# EAGLE design Board_4_Poti (EAGLE 9.6.2)
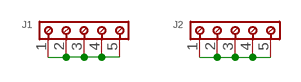
[diagram p0: schematic, sheet 1]

## Parts
J1  691508110305  [691508110305]
J2  691508110305  [691508110305]

## Nets
N$2: J1.1 J1.2 J1.3 J1.4 J1.5
N$3: J2.1 J2.2 J2.3 J2.4 J2.5

## Library data of the parts
J1 J2 = Wurth_Connectors_WR-TBL Rising Cage Clamp:691508110305: WR-TBL Serie 5081 - 3.50 mm Horizontal entry SMT Pressure Clamp KIND PROPERTIES Pitch 3.5 mm MATERIAL PROPERTIES Insulator Material LCP Insulator Flammability Rating UL94 V-0 Insulator Color Black Contact Material Brass Contact Plating Copper over Zinc Terminal Screw Material Steel Terminal Screw Plating Zinc Wire Guard Material Brass GENERAL INFORMATION Operating Temperature -40 up to +130 °C Compliance RoHS ELECTRICAL PROPERTIES IR UL 10 A Working Voltage [UL] 300 V (AC) Withstanding Voltage [UL] 1600 V (AC) Withstanding Voltage [cULus] 1600 V (AC) Contact Resistance [UL] 20 mΩ Contact Resistance [cULus] 20 mΩ MECHANICAL PROPERTIES Wire Strip Length 4 up to 5 (mm) Screw M2 Solid Wire Section (AWG) 30 to 16 (AWG) Solid Wire Section (Metric) 0.05 to 1.31 (mm²) Stranded Wire Section (AWG) 30 to 16 (AWG) Stranded Wire Section (Metric) 0.05 to 1.31 (mm²) CERTIFICATION cULus Approval E315414 UL Approval E315414 PACKAGING PROPERTIES Packaging Tape and Reel with Cap <https://katalog.we-online.com/media/images/v2/o58319v209%20Family_WR-TBL_Serie_5081_6915081103xx.jpg> Details see: https://katalog.we-online.com/en/em/TBL_3_50_5081_6915081103XX Updated by Ella Wu 2019-11-12 2019(C) Wurth Elektronik; DATASHEET-URL: https://www.we-online.com/catalog/datasheet/691508110305.pdf; IR-UL: 10A; MOUNT: THT; PART-NUMBER: 691508110305; PINS: 5; PITCH: 3.5mm; TYPE: Horizontal; WIRE: 30 to 16 (AWG) 0.05 to 1.31 (mm²); WORKING-VOLTAGE-UL: 300V (AC)

## Board
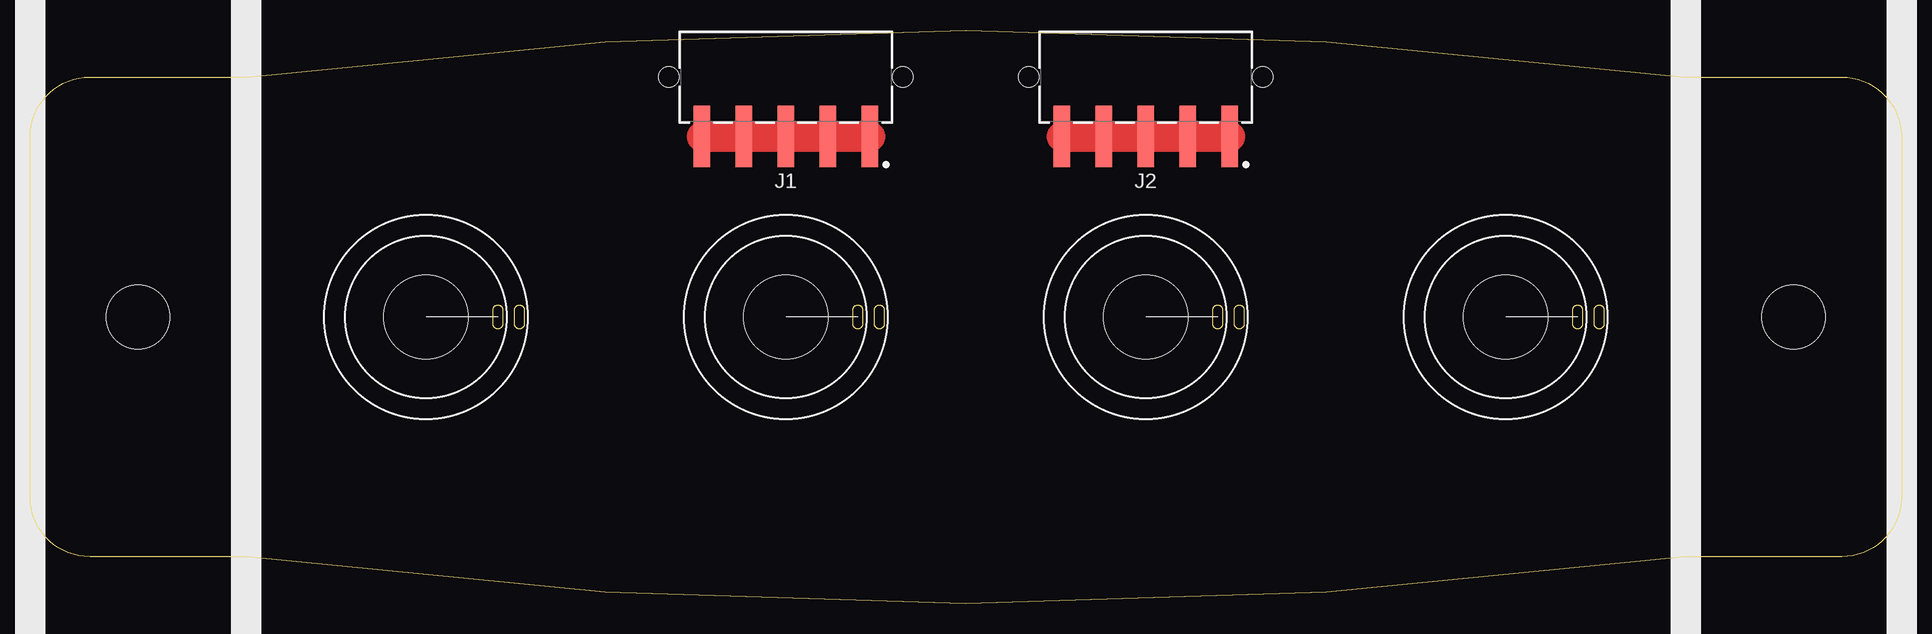
[diagram p1: board, top side]

Size 156 x 47.87 mm. Coordinates in mm from the lower left corner, seen from the top.
Outline: 18,3.93 5,3.93 arc-90 0,8.93 0,38.93 arc-90 5,43.93 18,43.93 arc-15 138,43.93 151,43.93 arc-90 156,38.93 156,8.93 arc-90 151,3.93 138,3.93 arc-15 18,3.93
Outline: 69.4,24.53 69.4,23.33 arc-90 69,22.93 arc-90 68.6,23.33 68.6,24.53 arc-90 69,24.93 arc-90 69.4,24.53
Outline: 99.4,24.53 99.4,23.33 arc-90 99,22.93 arc-90 98.6,23.33 98.6,24.53 arc-90 99,24.93 arc-90 99.4,24.53
Outline: 39.4,24.53 39.4,23.33 arc-90 39,22.93 arc-90 38.6,23.33 38.6,24.53 arc-90 39,24.93 arc-90 39.4,24.53
Outline: 129.4,24.53 129.4,23.33 arc-90 129,22.93 arc-90 128.6,23.33 128.6,24.53 arc-90 129,24.93 arc-90 129.4,24.53
Outline: 41.2,24.53 41.2,23.33 arc-90 40.8,22.93 arc-90 40.4,23.33 40.4,24.53 arc-90 40.8,24.93 arc-90 41.2,24.53
Outline: 71.2,24.53 71.2,23.33 arc-90 70.8,22.93 arc-90 70.4,23.33 70.4,24.53 arc-90 70.8,24.93 arc-90 71.2,24.53
Outline: 101.2,24.53 101.2,23.33 arc-90 100.8,22.93 arc-90 100.4,23.33 100.4,24.53 arc-90 100.8,24.93 arc-90 101.2,24.53
Outline: 131.2,24.53 131.2,23.33 arc-90 130.8,22.93 arc-90 130.4,23.33 130.4,24.53 arc-90 130.8,24.93 arc-90 131.2,24.53
Copper layers (1*16): Top 0.035mm / dielectric 1.5mm / Bottom 0.035mm
Design rules "default": minimum track width 6mil, minimum drill 0.35mm, track to track 6mil, track to pad 6mil, pad to pad 6mil, via to via 6mil, smd to smd 6mil, copper to edge 40mil, drill to drill 6mil, minimum pad ring 10mil, minimum via ring 8mil, stop-mask expansion 4mil, vias tented up to drill 0mil, thermal gap 10mil
Holes 5.3 mm at 9,23.93 147,23.93
Holes 7 mm at 63,23.93 93,23.93 33,23.93 123,23.93

### Footprints (pad centres in the part's own frame; a part is rotated, then mirrored left to right if it is on the bottom)
691508110305 = smd 1.4 x 5.1: 1 -7,4.95; 2 -3.5,4.95; 3 0,4.95; 4 3.5,4.95; 5 7,4.95 | hole 1.7: -9.75,0; 9.75,0

### Placement (x,y rotation side)
J1  63,43.93 180 top
J2  93,43.93 180 top

### Tracks (layer width: path | path; a pad name or v marks a point on that pad's centre or on a via)
N$2
  Top 2.54: J1.5 J1.4 J1.3 J1.2 J1.1
N$3
  Top 2.54: J2.5 J2.4 J2.3 J2.2 J2.1